# EAGLE design Blue_Cobra (EAGLE 6.5.0)
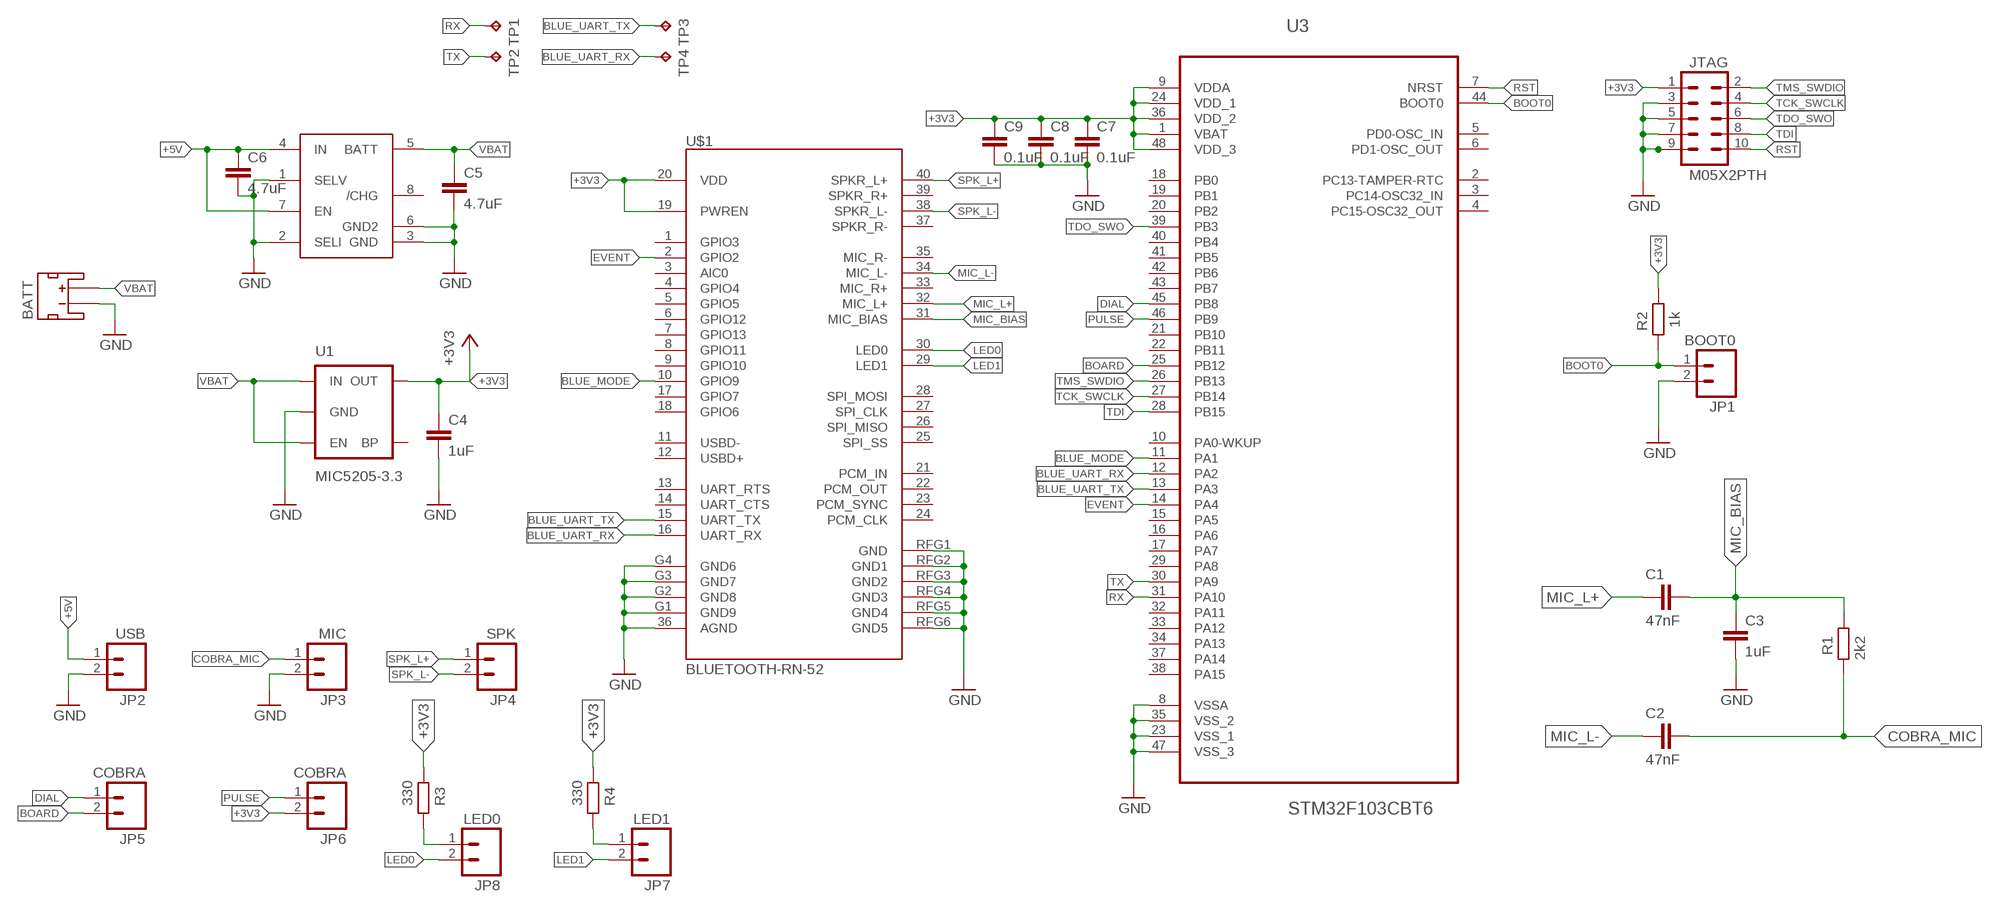
[diagram p0: schematic, sheet 1]

## Parts
BATT  JST_2MM_MALE  [JST-2-SMD]
C1  47nF  C-EUC0805  [C0805]
C2  47nF  C-EUC0805  [C0805]
C3  1uF  C-EUC0805  [C0805]
C4  1uF  C-EUC0805  [C0805]
C5  4.7uF  C-EUC0805  [C0805]
C6  4.7uF  C-EUC0805  [C0805]
C7  0.1uF  C-EUC0805  [C0805]
C8  0.1uF  C-EUC0805  [C0805]
C9  0.1uF  C-EUC0805  [C0805]
JP1  BOOT0  M021X02_NO_SILK  [1X02_NO_SILK]
JP2  USB  M021X02_NO_SILK  [1X02_NO_SILK]
JP3  MIC  M021X02_NO_SILK  [1X02_NO_SILK]
JP4  SPK  M021X02_NO_SILK  [1X02_NO_SILK]
JP5  COBRA  M021X02_NO_SILK  [1X02_NO_SILK]
JP6  COBRA  M021X02_NO_SILK  [1X02_NO_SILK]
JP7  LED1  M021X02_NO_SILK  [1X02_NO_SILK]
JP8  LED0  M021X02_NO_SILK  [1X02_NO_SILK]
JTAG  M05X2PTH  [AVR_ICSP]
R1  2k2  R-EU_R0805  [R0805]
R2  1k  R-EU_R0805  [R0805]
R3  330  R-EU_R0805  [R0805]
R4  330  R-EU_R0805  [R0805]
TP1  TPTP10SQ  [TP10SQ]
TP2  TPTP10SQ  [TP10SQ]
TP3  TPTP10SQ  [TP10SQ]
TP4  TPTP10SQ  [TP10SQ]
U1  MIC5205-3.3  MIC52053.3V  [SOT23-5]
U2  MAX1811SO8  [SO08]
U3  STM32F103CBT6  [QFP50P900X900X160-48N]
U$1  BLUETOOTH-RN-52  [RN-52]

## Nets
+3V3: C4.1 C7.1 C8.1 C9.1 JP6.2 JTAG.1 R2.2 R3.1 R4.1 U1.5(OUT) U3.1(VBAT) U3.9(VDDA) U3.24(VDD_1) U3.36(VDD_2) U3.48(VDD_3) U$1.19(PWREN) U$1.20(VDD)
+5V: C6.1 JP2.1 U2.4(IN) U2.7(EN)
BLUE_MODE: U3.11(PA1) U$1.10(GPIO9)
BLUE_UART_RX: TP4.TP U3.12(PA2) U$1.16(UART_RX)
BLUE_UART_TX: TP3.TP U3.13(PA3) U$1.15(UART_TX)
BOARD: JP5.2 U3.25(PB12)
BOOT0: JP1.1 R2.1 U3.44(BOOT0)
COBRA_MIC: C2.2 JP3.1 R1.1
DIAL: JP5.1 U3.45(PB8)
EVENT: U3.14(PA4) U$1.2(GPIO2)
GND: BATT.1(-) C3.2 C4.2 C5.2 C6.2 C7.2 C8.2 C9.2 JP1.2 JP2.2 JP3.2 JTAG.3 JTAG.5 JTAG.7 JTAG.9 U1.2(GND) U2.1(SELV) U2.2(SELI) U2.3(GND) U2.6(GND2) U3.8(VSSA) U3.23(VSS_1) U3.35(VSS_2) U3.47(VSS_3) U$1.36(AGND) U$1.G1(GND9) U$1.G2(GND8) U$1.G3(GND7) U$1.G4(GND6) U$1.RFG1(GND) U$1.RFG2(GND1) U$1.RFG3(GND2) U$1.RFG4(GND3) U$1.RFG5(GND4) U$1.RFG6(GND5)
LED0: JP8.2 U$1.30(LED0)
LED1: JP7.2 U$1.29(LED1)
MIC_BIAS: C1.2 C3.1 R1.2 U$1.31(MIC_BIAS)
MIC_L+: C1.1 U$1.32(MIC_L+)
MIC_L-: C2.1 U$1.34(MIC_L-)
N$1: JP8.1 R3.2
N$2: JP7.1 R4.2
PULSE: JP6.1 U3.46(PB9)
RST: JTAG.10 U3.7(NRST)
RX: TP1.TP U3.31(PA10)
SPK_L+: JP4.1 U$1.40(SPKR_L+)
SPK_L-: JP4.2 U$1.38(SPKR_L-)
TCK_SWCLK: JTAG.4 U3.27(PB14)
TDI: JTAG.8 U3.28(PB15)
TDO_SWO: JTAG.6 U3.39(PB3)
TMS_SWDIO: JTAG.2 U3.26(PB13)
TX: TP2.TP U3.30(PA9)
VBAT: BATT.2(+) C5.1 U1.1(IN) U1.3(EN) U2.5(BATT)
Unconnected: BATT.NC1(PAD1) BATT.NC2(PAD2) U1.4(BP) U2.8(/CHG) U3.2(PC13-TAMPER-RTC) U3.3(PC14-OSC32_IN) U3.4(PC15-OSC32_OUT) U3.5(PD0-OSC_IN) U3.6(PD1-OSC_OUT) U3.10(PA0-WKUP) U3.15(PA5) U3.16(PA6) U3.17(PA7) U3.18(PB0) U3.19(PB1) U3.20(PB2) U3.21(PB10) U3.22(PB11) U3.29(PA8) U3.33(PA12) U3.34(PA13) U3.37(PA14) U3.38(PA15) U3.40(PB4) U3.41(PB5) U3.42(PB6) U3.43(PB7) U$1.1(GPIO3) U$1.3(AIC0) U$1.4(GPIO4) U$1.5(GPIO5) U$1.6(GPIO12) U$1.7(GPIO13) U$1.8(GPIO11) U$1.9(GPIO10) U$1.11(USBD-) U$1.12(USBD+) U$1.13(UART_RTS) U$1.14(UART_CTS) U$1.17(GPIO7) U$1.18(GPIO6) U$1.21(PCM_IN) U$1.22(PCM_OUT) U$1.23(PCM_SYNC) U$1.24(PCM_CLK) U$1.25(SPI_SS) U$1.26(SPI_MISO) U$1.27(SPI_CLK) U$1.28(SPI_MOSI) U$1.33(MIC_R+) U$1.35(MIC_R-) U$1.37(SPKR_R-) U$1.39(SPKR_R+)

## Power pins joined to a net without a drawn wire
PA11: U3.32(PA11)

## Library data of the parts
BATT = SparkFun-Connectors:JST_2MM_MALE: Mates to single-cell LiPo batteries. CONN-08352; PROD_ID: CONN-08352
C1-C9 = rcl:C-EU: CAPACITOR, European symbol
JP1-JP8 = SparkFun-Connectors:M02: Standard 2-pin 0.1" header. Use with - straight break away headers ( PRT-00116) - right angle break away headers (PRT-00553) - swiss pins (PRT-00743) - machine pins (PRT-00117) - female headers (PRT-00115) Molex polarized connector foot print use with: PRT-08233 with associated crimp pins and housings. 2.54_SCREWTERM for use with PRT-10571. 3.5mm Screw Terminal footprints for PRT-08084 5mm Screw Terminal footprints for use with PRT-08433
JTAG = SparkFun-Connectors:M05X2: Header 5x2 Standard 10-pin dual row 0.1" header. Commonly used with AVR-ISP. Use with Spark Fun Electronics SKU: PRT-00778
R1-R4 = rcl:R-EU_: RESISTOR, European symbol
TP1-TP4 = testpad:TP: Test pad
U1 = SparkFun-PowerIC:MIC5205: MIC5205 150mA vreg 3.3V - VREG-00822 5V - VREG-00823; PROD_ID: VREG-00822
U2 = adafruit:MAX1811: Maxim MAX1811 USB li-ion battery charger http://www.ladyada.net/library/eagle
U3 = STM32F103CBT6@E:STM32F103CBT6: Medium-density performance line ARM-based 32-bit MCU; MPN: STM32F103CBT6; OC_FARNELL: 1606327; OC_NEWARK: 11N8296; PACKAGE: QFP-48; SUPPLIER: STMICROELECTRONICS
U$1 = SparkFun-RF:BLUETOOTH-RN-52

## Board
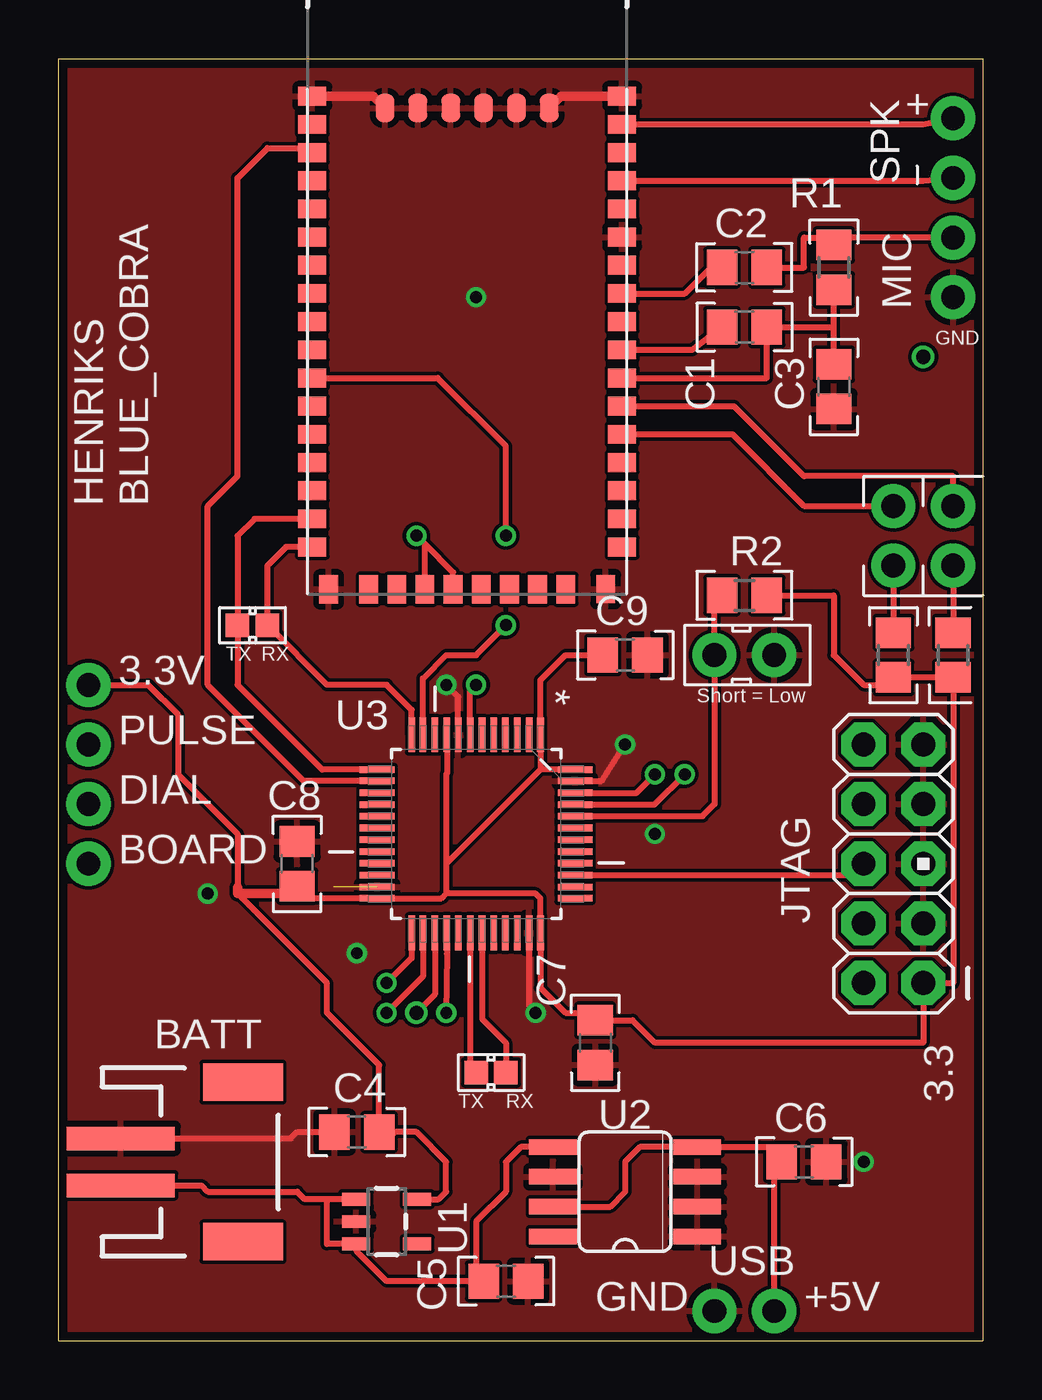
[diagram p1: board, top side]
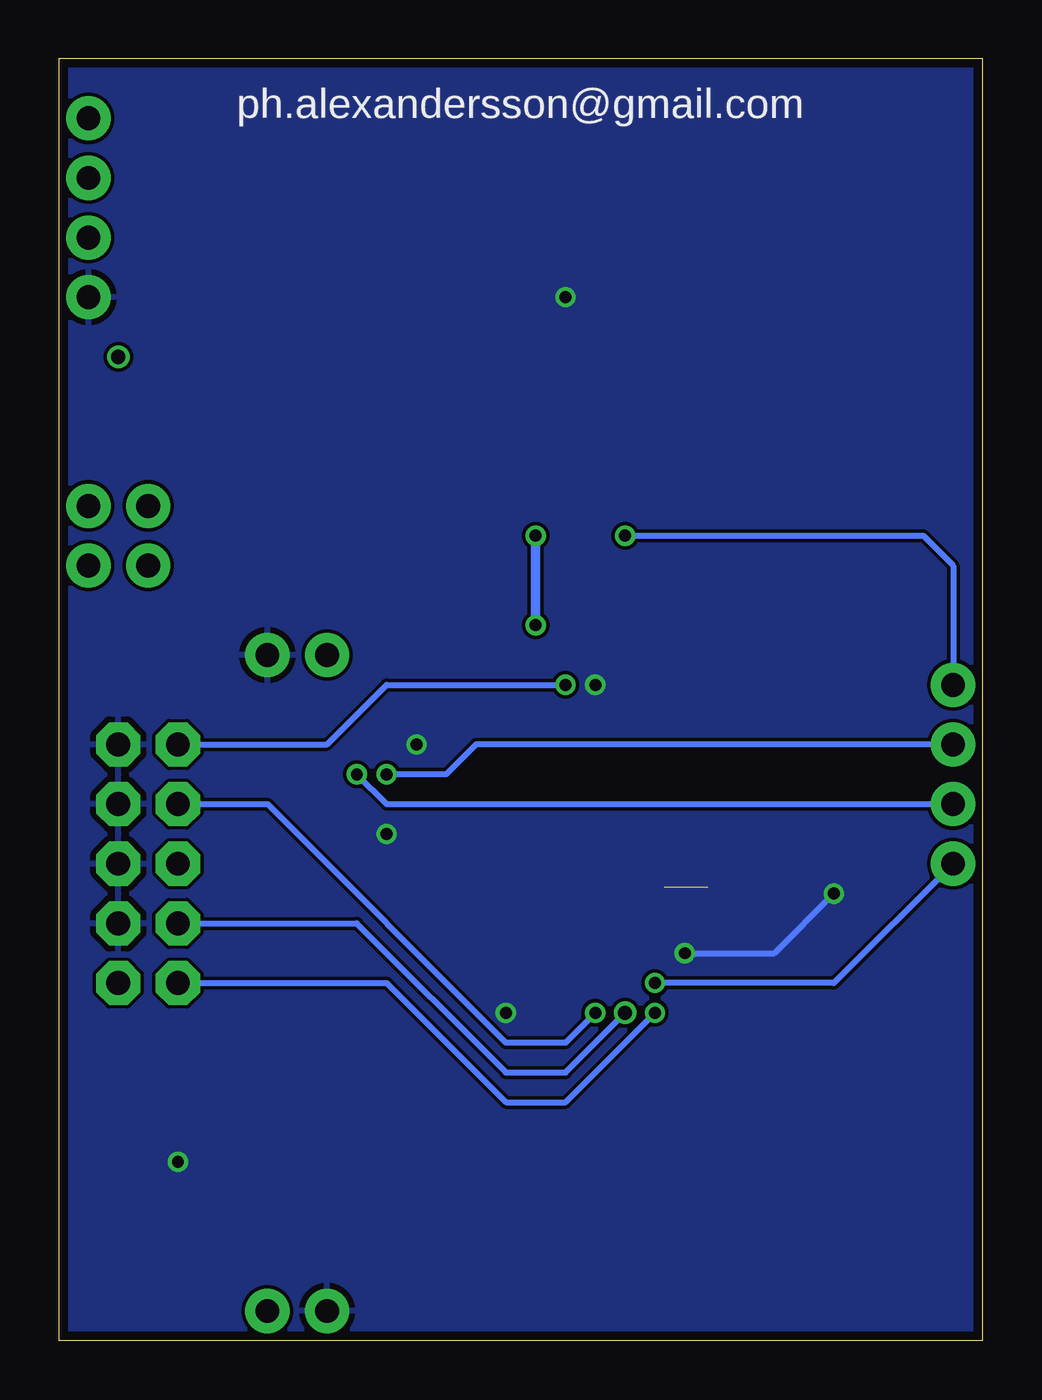
[diagram p2: board, bottom side, seen from below]

Size 39.37 x 54.61 mm. Coordinates in mm from the lower left corner, seen from the top.
Outline: 0,0 39.37,0 39.37,54.61 0,54.61 0,0
Copper layers (1*16): Top 0.0356mm / dielectric 1.5011mm / Bottom 0.0356mm
Design rules "OSH_park": minimum track width 6mil, minimum drill 13mil, track to track 6mil, track to pad 6mil, pad to pad 6mil, via to via 6mil, smd to smd 6mil, copper to edge 15mil, drill to drill 6mil, minimum pad ring 7mil, minimum via ring 7mil, stop-mask expansion 3mil, vias tented up to drill 0mil, thermal gap 10mil

### Footprints (pad centres in the part's own frame; a part is rotated, then mirrored left to right if it is on the bottom)
JST-2-SMD = smd 1 x 4.6: 1 -1,-3.7; 2 1,-3.7 | smd 1.6 x 3.4: NC1 -3.4,1.5; NC2 3.4,1.5
C0805 = smd 1.3 x 1.5: 1 -0.95,0; 2 0.95,0
1X02_NO_SILK = drill 1.016 pad 1.88: 1 0,0; 2 2.54,0
AVR_ICSP = drill 1.016 pad 1.88 octagon: 1 -1.27,5.08; 2 1.27,5.08; 3 -1.27,2.54; 4 1.27,2.54; 5 -1.27,0; 6 1.27,0; 7 -1.27,-2.54; 8 1.27,-2.54; 9 -1.27,-5.08; 10 1.27,-5.08
R0805 = smd 1.3 x 1.5: 1 -0.95,0; 2 0.95,0
TP10SQ = smd 1 x 1: TP 0,0
SOT23-5 = smd 0.55 x 1.2: 1 -0.95,-1.3; 2 0,-1.3; 3 0.95,-1.3; 4 0.95,1.3; 5 -0.95,1.3
SO08 = smd 0.66 x 2.032: 1 -1.905,-3.073; 2 -0.635,-3.073; 3 0.635,-3.073; 4 1.905,-3.073; 5 1.905,3.073; 6 0.635,3.073; 7 -0.635,3.073; 8 -1.905,3.073
QFP50P900X900X160-48N = smd 1.473 x 0.279: 1 -4.216,2.743; 2 -4.216,2.261; 3 -4.216,1.753; 4 -4.216,1.245; 5 -4.216,0.762; 6 -4.216,0.254; 7 -4.216,-0.254; 8 -4.216,-0.762; 9 -4.216,-1.245; 10 -4.216,-1.753; 11 -4.216,-2.261; 12 -4.216,-2.743; 25 4.216,-2.743; 26 4.216,-2.261; 27 4.216,-1.753; 28 4.216,-1.245; 29 4.216,-0.762; 30 4.216,-0.254; 31 4.216,0.254; 32 4.216,0.762; 33 4.216,1.245; 34 4.216,1.753; 35 4.216,2.261; 36 4.216,2.743 | smd 0.279 x 1.473: 13 -2.743,-4.216; 14 -2.261,-4.216; 15 -1.753,-4.216; 16 -1.245,-4.216; 17 -0.762,-4.216; 18 -0.254,-4.216; 19 0.254,-4.216; 20 0.762,-4.216; 21 1.245,-4.216; 22 1.753,-4.216; 23 2.261,-4.216; 24 2.743,-4.216; 37 2.743,4.216; 38 2.261,4.216; 39 1.753,4.216; 40 1.245,4.216; 41 0.762,4.216; 42 0.254,4.216; 43 -0.254,4.216; 44 -0.762,4.216; 45 -1.245,4.216; 46 -1.753,4.216; 47 -2.261,4.216; 48 -2.743,4.216
RN-52 = smd 1.2 x 0.8: 1 -6.6,8.33; 2 -6.6,7.13; 3 -6.6,5.93; 4 -6.6,4.73; 5 -6.6,3.53; 6 -6.6,2.33; 7 -6.6,1.13; 8 -6.6,-0.07; 9 -6.6,-1.27; 10 -6.6,-2.47; 11 -6.6,-3.67; 12 -6.6,-4.87; 13 -6.6,-6.07; 14 -6.6,-7.27; 15 -6.6,-8.47; 16 -6.6,-9.67; 25 6.6,-9.67; 26 6.6,-8.47; 27 6.6,-7.27; 28 6.6,-6.07; 29 6.6,-4.87; 30 6.6,-3.67; 31 6.6,-2.47; 32 6.6,-1.27; 33 6.6,-0.07; 34 6.6,1.13; 35 6.6,2.33; 36 6.6,3.53; 37 6.6,4.73; 38 6.6,5.93; 39 6.6,7.13; 40 6.6,8.33; G1 -6.6,9.53; G4 6.6,9.53 | smd 0.8 x 1.2: 17 -4.2,-11.47; 18 -3,-11.47; 19 -1.8,-11.47; 20 -0.6,-11.47; 21 0.6,-11.47; 22 1.8,-11.47; 23 3,-11.47; 24 4.2,-11.47; G2 -5.9,-11.47; G3 5.9,-11.46; RFG1 -3.5,9.03; RFG2 -2.1,9.03; RFG3 -0.7,9.03; RFG4 0.7,9.03; RFG5 2.1,9.03; RFG6 3.5,9.03

### Placement (x,y rotation side)
BATT  6.35,7.62 270 top
C1  29.21,43.18 0 top
C2  29.21,45.72 0 top
C3  33.02,40.64 270 top
C4  12.7,8.89 180 top
C5  19.05,2.54 0 top
C6  31.75,7.62 0 top
C7  22.86,12.7 270 top
C8  10.16,20.32 90 top
C9  24.13,29.21 0 top
JP1  27.94,29.21 0 top
JP2  30.48,1.27 180 top
JP3  38.1,46.99 270 top
JP4  38.1,52.07 270 top
JP5  1.27,22.86 270 top
JP6  1.27,25.4 90 top
JP7  35.56,33.02 90 top
JP8  38.1,33.02 90 top
JTAG  35.56,20.32 180 top
R1  33.02,45.72 270 top
R2  29.21,31.75 0 top
R3  38.1,29.21 90 top
R4  35.56,29.21 90 top
TP1  19.05,11.43 0 top
TP2  17.78,11.43 0 top
TP3  7.62,30.48 0 top
TP4  8.89,30.48 0 top
U1  13.97,5.08 270 top
U2  24.13,6.35 90 top
U3  17.78,21.59 270 top
U$1  17.4,43.48 0 top

### Tracks (layer width: path | path; a pad name or v marks a point on that pad's centre or on a via)
+3V3  (via drill 0.51)
  Top 0.254: 16.51,19.05 16.31,18.85 U3.24 10.36,18.85 10.16,19.05 C8.1 | 16.54,25.43 16.54,24.16 16.51,24.13 16.51,20.32 | 16.51,20.32 16.51,19.05 | U3.9 16.54,25.43 | 16.54,25.43 16.51,25.4 | R2.2 33.02,31.75 33.02,29.21 34.29,27.94 35.24,27.94 R4.1 R3.1 38.1,15.24 JTAG.1 36.83,12.7 25.4,12.7 24.45,13.65 C7.1 22.54,13.97 21.59,13.97 20.52,15.04 U3.36 20.52,18.85 20.32,19.05 16.51,19.05 | JP6.2 3.81,27.94 5.08,26.67 5.08,24.13 7.62,21.59 7.62,19.3 | 7.62,19.05 11.43,15.24 11.43,13.97 13.65,11.75 C4.1 14,8.54 14.35,8.89 15.24,8.89 16.51,7.62 16.51,6.35 16.19,6.03 U1.5 | 20.52,24.33 16.51,20.32 | U$1.19 15.6,33.93 | 15.6,33.93 v15.24,34.29 | U$1.20 16.8,32.73 15.6,33.93 | C9.1 21.59,29.21 20.52,28.14 U3.1 20.52,24.33 | U3.48 20.52,24.33
  Top 0.406: 10.16,19.05 7.62,19.05 7.62,19.3
  Bottom 0.254: v15.24,34.29 2.54,34.29 1.27,33.02 JP6.2
+5V
  Top 0.254: JP2.1 30.48,7.3 C6.1 30.16,8.26 U2.4 24.77,8.26 24.13,7.62 24.13,6.35 23.5,5.71 U2.7
BLUE_MODE  (via drill 0.51)
  Top 0.254: U3.11 15.52,28.22 16.51,29.21 17.78,29.21 v19.05,30.48 | v19.05,34.29 19.05,38.1 16.14,41.01 U$1.10
  Bottom 0.406: v19.05,30.48 v19.05,34.29
BLUE_UART_RX
  Top 0.254: U3.12 15.04,26.87 13.97,27.94 11.43,27.94 TP4.TP 8.89,33.02 9.68,33.81 U$1.16
BLUE_UART_TX
  Top 0.254: U3.13 11.23,24.33 7.62,27.94 TP3.TP 7.62,34.29 8.34,35.01 U$1.15
BOARD  (via drill 0.51)
  Top 0.254: U3.25 15.04,16.31 v13.97,15.24
  Bottom 0.254: JP5.2 6.35,15.24 v13.97,15.24
BOOT0
  Top 0.254: U3.44 27.43,22.35 27.94,22.86 JP1.1 27.94,31.43 R2.1
COBRA_MIC
  Top 0.254: C2.2 31.75,45.72 31.75,46.99 33.02,46.99 | JP3.1 33.02,46.99 | 33.02,46.99 R1.1
DIAL  (via drill 0.51)
  Top 0.254: U3.45 25.38,22.84 v26.67,24.13
  Bottom 0.254: v26.67,24.13 25.4,22.86 JP5.1
EVENT
  Top 0.254: U3.14 10.44,23.85 6.35,27.94 6.35,35.56 7.62,36.83 7.62,49.53 8.89,50.8 10.61,50.8 U$1.2
GND  (via drill 0.51)  (1 unrouted)
  Top 0.254: U3.47 23.14,23.85 v24.13,25.4 | U3.8 17.02,27.43 v16.51,27.94 | U3.35 20.04,14.25 v20.32,13.97 | BATT.1 9.89,8.62 10.16,8.89 C4.2
  Top 0.406: U$1.G1 13.4,53.01 U$1.RFG1 | U$1.G4 21.4,53.01 U$1.RFG6
  Bottom 0.254: v12.7,16.51 8.89,16.51 v6.35,19.05
  other vias: 34.29,7.62 25.4,21.59 17.78,44.45
  pour Top: 0,54.61 39.37,54.61 39.37,0 0,0
  pour Bottom: 0,54.61 39.37,54.61 39.37,0 0,0
LED0
  Top 0.254: JP8.2 38.1,36.83 31.75,36.83 28.77,39.81 U$1.30
LED1
  Top 0.254: JP7.2 31.75,35.56 28.7,38.61 U$1.29
MIC_BIAS
  Top 0.254: 33.02,41.91 C3.1 33.02,43.18 | 33.02,43.18 R1.2 | U$1.31 30.16,41.01 C1.2 33.02,43.18
MIC_L+
  Top 0.254: U$1.32 26.99,42.21 C1.1
MIC_L-
  Top 0.254: U$1.34 26.67,44.61 27.78,45.72 C2.1
N$1
  Top 0.254: JP8.1 R3.2
N$2
  Top 0.254: JP7.1 R4.2
N$3  (via drill 0.6)
  other vias: 36.83,41.91
PULSE  (via drill 0.51)
  Top 0.254: U3.46 24.61,23.34 v25.4,24.13
  Bottom 0.254: JP6.1 21.59,25.4 22.86,24.13 v25.4,24.13
RST  (via drill 0.51)
  Top 0.254: U3.7 17.53,27.69 v17.78,27.94
  Bottom 0.254: JTAG.10 27.94,25.4 25.4,27.94 v17.78,27.94
RX
  Top 0.254: U3.31 18.03,13.72 19.05,12.7 TP1.TP
SPK_L+
  Top 0.254: U$1.40 36.83,51.81 JP4.1
SPK_L-
  Top 0.254: U$1.38 36.83,49.41 JP4.2
TCK_SWCLK  (via drill 0.6)
  Top 0.254: U3.27 16.03,14.76 v15.24,13.97
  Bottom 0.254: JTAG.4 26.67,17.78 20.32,11.43 17.78,11.43 v15.24,13.97
TDI  (via drill 0.51)
  Top 0.254: U3.28 16.54,16.48 v16.51,13.97
  Bottom 0.254: JTAG.8 30.48,22.86 20.32,12.7 17.78,12.7 v16.51,13.97
TDO_SWO
  Top 0.254: U3.39 33.81,19.84 JTAG.6
TMS_SWDIO  (via drill 0.51)
  Top 0.254: U3.26 15.52,15.52 v13.97,13.97
  Bottom 0.254: JTAG.2 25.4,15.24 20.32,10.16 17.78,10.16 v13.97,13.97
TX
  Top 0.254: U3.30 17.53,11.68 TP2.TP
VBAT
  Top 0.254: U2.5 19.68,8.26 19.05,7.62 19.05,6.35 17.78,5.08 17.78,2.86 C5.1 13.97,2.54 12.7,3.81 12.7,4.1 U1.3 11.43,4.13 11.43,6.03 | BATT.2 6.08,6.62 6.35,6.35 10.16,6.35 10.48,6.03 11.43,6.03 | U1.1 11.43,6.03

### Text on the board
tPlace: + | SPK | MIC | GND | HENRIKS / BLUE_COBRA | TX | RX | 3.3V | Short = Low | PULSE | DIAL | BOARD | TX | RX | 3.3 | USB | GND | +5V
bPlace: ph.alexandersson@gmail.com